# EAGLE schematic Sopranino2G-172 (EAGLE 9.0.1)
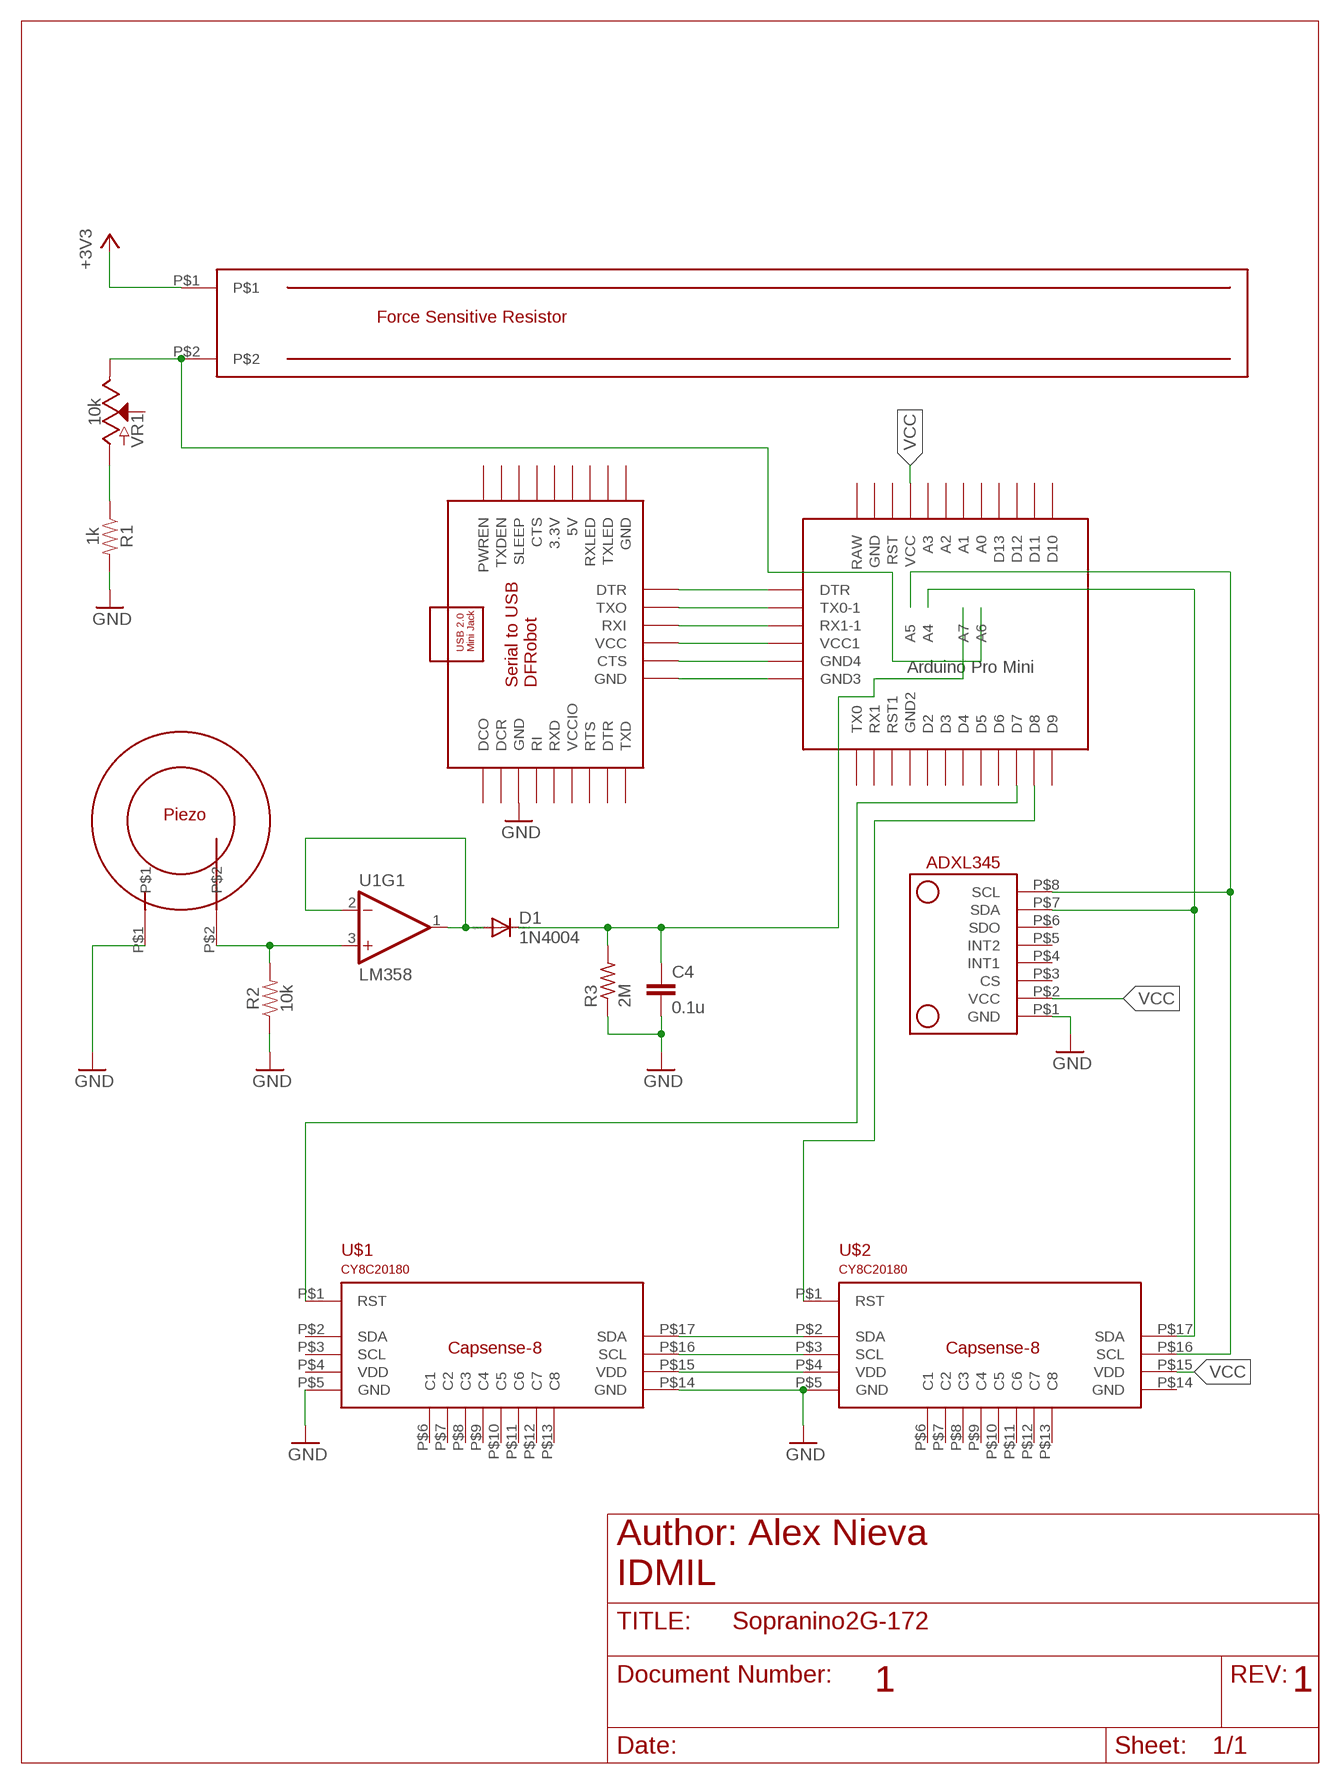
[diagram p0: schematic, sheet 1]

## Parts
C4  0.1u  C5/5.5  [C5B5.5]
D1  1N4004  [DO41-10]
R1  1k  1KOHM-HORIZ-1/4W-1%  [AXIAL-0.3]
R2  10k  10KOHM-HORIZ-1/4W-1%  [AXIAL-0.3]
R3  2M  R-US_0204/7  [0204/7]
U1  LM358  [DIP08]
U$1  CAPSENSE-8  [CAPSENSE-8]
U$2  CAPSENSE-8  [CAPSENSE-8]
U$3  ADXL345  [ADXL345]
U$4  PRO-MINI-2  [PRO-MINI-2]
U$5  FSR_T-STICK  [FSR_T-STICK]
U$6  FTDI_DFROBOT  (no package)
U$7  PIEZO_TSTICK  [PIEZO_TSTICK]
VR1  10k  POTENTIOMETER-PTH-9MM-1/20W-20%  [POT-PTH-ALPS]

## Nets
+3V3: U$5.P$1
GND: C4.2 R1.P$2 R2.P$1 R3.1 U$1.P$5(GND) U$1.P$14(GND) U$2.P$5(GND) U$3.P$1(GND) U$6.GND U$7.P$1
N$1: U$1.P$1(RST) U$4.D7
N$2: D1.A U1.1(OUT) U1.2(-IN)
N$3: U$1.P$17(SDA) U$2.P$2(SDA)
N$4: U$4.DTR U$6.DTR
N$5: U$4.TX0-1 U$6.TXO
N$6: U$2.P$1(RST) U$4.D8
N$7: U$1.P$16(SCL) U$2.P$3(SCL)
N$8: U$1.P$15(VDD) U$2.P$4(VDD)
N$9: U$4.RX1-1 U$6.RXI
N$10: U$4.VCC1 U$6.VCC
N$11: U$4.GND3(GND4) U$6.CTS
N$12: R1.P$1 VR1.P$3(A)
N$13: U$4.A6 U$5.P$2 VR1.P$1(E)
N$14: U$4.GND2(GND3) U$6.GND
N$15: C4.1 D1.C R3.2 U$4.A7
N$16: R2.P$2 U1.3(+IN) U$7.P$2
SCL: U$2.P$16(SCL) U$3.P$8(SCL) U$4.A5
SDA: U$2.P$17(SDA) U$3.P$7(SDA) U$4.A4
VCC: U$2.P$15(VDD) U$3.P$2(VCC) U$4.VCC
Unconnected: U1.4(P$V-) U1.5(+IN) U1.6(-IN) U1.7(OUT) U1.8(P$V+) U$1.P$2(SDA) U$1.P$3(SCL) U$1.P$4(VDD) U$1.P$6(C1) U$1.P$7(C2) U$1.P$8(C3) U$1.P$9(C4) U$1.P$10(C5) U$1.P$11(C6) U$1.P$12(C7) U$1.P$13(C8) U$2.P$6(C1) U$2.P$7(C2) U$2.P$8(C3) U$2.P$9(C4) U$2.P$10(C5) U$2.P$11(C6) U$2.P$12(C7) U$2.P$13(C8) U$2.P$14(GND) U$3.P$3(CS) U$3.P$4(INT1) U$3.P$5(INT2) U$3.P$6(SDO) U$4.A0 U$4.A1 U$4.A2 U$4.A3 U$4.D2 U$4.D3 U$4.D4 U$4.D5 U$4.D6 U$4.D9 U$4.D10 U$4.D11 U$4.D12 U$4.D13 U$4.GND U$4.GND1(GND2) U$4.RAW U$4.RST U$4.RST1 U$4.RX1 U$4.TX0 U$6.3.3V U$6.5V U$6.CTS U$6.DCO U$6.DCR U$6.DTR U$6.GND U$6.PWREN U$6.RI U$6.RTS U$6.RXD U$6.RXLED U$6.SLEEP U$6.TXD U$6.TXDEN U$6.TXLED U$6.VCCIO VR1.P$2(S)

## Notes on the sheet
- Author: Alex Nieva
  IDMIL
- 1 | 1

## Library data of the parts
C4 = capacitor-wima:C: CAPACITOR naming: grid - package width
D1 = diode:1N4004: DIODE general purpose rectifier, 1 A
R1 = SparkFun-Resistors:1KOHM: 1kΩ resistor A resistor is a passive two-terminal electrical component that implements electrical resistance as a circuit element. Resistors act to reduce current flow, and, at the same time, act to lower voltage levels within circuits. - Wikipedia; PROD_ID: RES-12182
R2 = SparkFun-Resistors:10KOHM: 10kΩ resistor A resistor is a passive two-terminal electrical component that implements electrical resistance as a circuit element. Resistors act to reduce current flow, and, at the same time, act to lower voltage levels within circuits. - Wikipedia; PROD_ID: RES-12183
R3 = resistor:R-US_: RESISTOR, American symbol
U1 = SparkFun-IC-Amplifiers:LM358: LM358 Jellybean op-amp Datasheet <http://www.sparkfun.com/datasheets/Components/General/LM358.pdf> SparkFun Products Op-Amp (Thru-Hole) - LM358 <https://www.sparkfun.com/products/9456> (COM-09456); PROD_ID: IC-09172
U$1 U$2 = T-Stick:CAPSENSE-8: Capsense CY8C20180 for the Sopranino T-Sticks
U$3 = davidbeermann:ADXL345: ADXL345 Digital 3-Axis Accelerometer The sensor module ADXL345 is a 3-axis accelerometer with low power consumption. This module was purchased at Eckstein Komponente <http://eckstein-shop.de/GY-291-ADXL345-Digital-3-Axis-Gravity-Acceleration-Beschleunigung-Sensor_1>.
U$4 = Arduino-clone:PRO-MINI-2: Arduino Pro Mini Layout 2 Sparkfun.com
U$5 = T-Stick:FSR_T-STICK: FSR for the T-Stick DMI
U$6 = T-Stick:FTDI_DFROBOT
U$7 = T-Stick:PIEZO_TSTICK
VR1 = SparkFun-Resistors:POTENTIOMETER: Potentiometer (Pot) Three-terminal potentiometers, with an adjustable wiper and two adjustable resistors. A pot can be used to create a configurable voltage divider, or as a variable resistor. Variants ALPS_POT and ALPS_POT_KIT - PTH, breadboard compatible, 9mm square pots Rotary Potentiometer - Linear (10k ohm) <https://www.sparkfun.com/products/9288> (COM-09288) The KIT variant exposes copper on only one side of the PTH pad, so the part can only be assembled on one side of the PCB. Useful for beginner soldering kits.; PROD_ID: RES-09177; SF_SKU: COM-09288

## Net classes
1 power: width 0.61 mm, clearance 0.254 mm
3 usbvcc: width 0.356 mm, clearance 0.254 mm